# Altium schematic sheet MS4525DO GH1.25.schdoc
size 124 x 50 mm
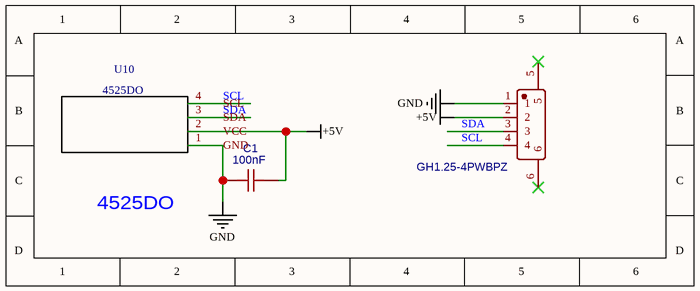
[diagram p0: MS4525DO GH1.25.schdoc]

## Parts
C1  100nF  [C0603]
U4  GH1.25-4PWBPZ  [CONN-SMD_GH1.25-4PWBPZ]
U10  4525DO  [4525DO-DS5AI00DP]

## Nets
+5V: C1.2 U4.2 U10.2(VCC)
GND: C1.1 U4.1 U10.1(GND)
SCL: U4.4 U10.4(SCL)
SDA: U4.3 U10.3(SDA)

Not connected (* = marked no-connect by the designer): U4 5* 6*

## Library data of the parts
C1 = 100nF: Manufacturer: SAMSUNG; Manufacturer Part: CL10B104KC8NNNC; nameAlias: Capacitance; SMT Type: Extend; Supplier: LCSC; Supplier Part: C15725; LCSC Assembly: Yes; spicePre: C; spiceSymbolName: CL10B104KC8NNNC
U4 = GH1.25-4PWBPZ: Manufacturer: BOOMELE(博穆精密); Contributor: LCSC; Supplier: LCSC; Supplier Part: C2829253; Manufacturer Part: GH1.25-4PWBPZ; JLCPCB Part Class: Extended Part; spicePre: U; spiceSymbolName: GH1.25-4PWBPZ